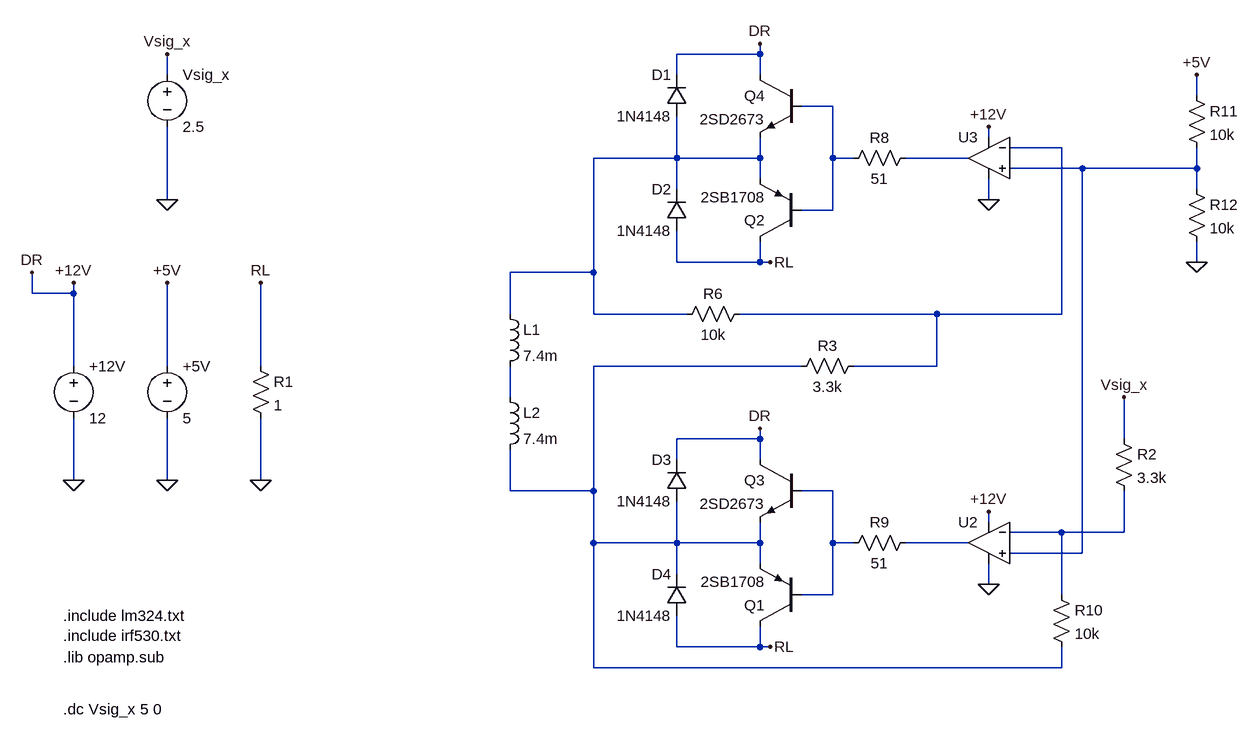
[diagram p0: schematic MagLev_02.asc]
MagLev_02.asc, the LTspice schematic file:
Version 4
SHEET 1 1432 960
WIRE -208 -1264 -208 -1280
WIRE -208 -1264 -336 -1264
WIRE -1120 -1232 -1120 -1264
WIRE -336 -1232 -336 -1264
WIRE -208 -1232 -208 -1264
WIRE 464 -1200 464 -1232
WIRE -96 -1184 -144 -1184
WIRE 144 -1136 144 -1152
WIRE 256 -1120 176 -1120
WIRE -336 -1104 -336 -1168
WIRE -336 -1104 -464 -1104
WIRE -208 -1104 -208 -1136
WIRE -208 -1104 -336 -1104
WIRE -96 -1104 -96 -1184
WIRE -64 -1104 -96 -1104
WIRE 112 -1104 16 -1104
WIRE 288 -1088 176 -1088
WIRE 464 -1088 464 -1120
WIRE 464 -1088 288 -1088
WIRE -208 -1072 -208 -1104
WIRE -336 -1056 -336 -1104
WIRE 464 -1056 464 -1088
WIRE -1120 -1040 -1120 -1152
WIRE 144 -1040 144 -1072
WIRE -96 -1024 -96 -1104
WIRE -96 -1024 -144 -1024
WIRE -336 -944 -336 -992
WIRE -208 -944 -208 -976
WIRE -208 -944 -336 -944
WIRE -192 -944 -208 -944
WIRE 464 -944 464 -976
WIRE -464 -928 -464 -1104
WIRE -464 -928 -592 -928
WIRE -1328 -896 -1328 -928
WIRE -1264 -896 -1264 -912
WIRE -1264 -896 -1328 -896
WIRE -592 -864 -592 -928
WIRE -464 -864 -464 -928
WIRE -320 -864 -464 -864
WIRE 64 -864 -240 -864
WIRE 256 -864 256 -1120
WIRE 256 -864 64 -864
WIRE -1264 -784 -1264 -896
WIRE -1120 -784 -1120 -912
WIRE -976 -784 -976 -912
WIRE -144 -784 -464 -784
WIRE 64 -784 64 -864
WIRE 64 -784 -64 -784
WIRE -592 -736 -592 -784
WIRE -208 -672 -208 -688
WIRE -208 -672 -336 -672
WIRE 352 -672 352 -736
WIRE -336 -640 -336 -672
WIRE -208 -640 -208 -672
WIRE -1264 -608 -1264 -704
WIRE -1120 -608 -1120 -704
WIRE -976 -608 -976 -704
WIRE -592 -592 -592 -656
WIRE -464 -592 -464 -784
WIRE -464 -592 -592 -592
WIRE -96 -592 -144 -592
WIRE 144 -544 144 -560
WIRE 256 -528 176 -528
WIRE 352 -528 352 -592
WIRE 352 -528 256 -528
WIRE -464 -512 -464 -592
WIRE -336 -512 -336 -576
WIRE -336 -512 -464 -512
WIRE -208 -512 -208 -544
WIRE -208 -512 -336 -512
WIRE -96 -512 -96 -592
WIRE -64 -512 -96 -512
WIRE 112 -512 16 -512
WIRE 288 -496 288 -1088
WIRE 288 -496 176 -496
WIRE -208 -480 -208 -512
WIRE -336 -464 -336 -512
WIRE 144 -448 144 -480
WIRE -96 -432 -96 -512
WIRE -96 -432 -144 -432
WIRE 256 -432 256 -528
WIRE -336 -352 -336 -400
WIRE -208 -352 -208 -384
WIRE -208 -352 -336 -352
WIRE -192 -352 -208 -352
WIRE -464 -320 -464 -512
WIRE 256 -320 256 -352
WIRE 256 -320 -464 -320
FLAG -1120 -608 0
FLAG -1264 -912 +12V
FLAG -1264 -608 0
FLAG -1120 -912 +5V
FLAG -1120 -1040 0
FLAG -1120 -1264 Vsig_x
FLAG 464 -1232 +5V
FLAG 464 -944 0
FLAG -976 -608 0
FLAG -976 -912 RL
FLAG -1328 -928 DR
FLAG 352 -736 Vsig_x
FLAG -208 -688 DR
FLAG -192 -352 RL
FLAG -208 -1280 DR
FLAG -192 -944 RL
FLAG 144 -1040 0
FLAG 144 -1152 +12V
FLAG 144 -448 0
FLAG 144 -560 +12V
SYMBOL voltage -1120 -800 R0
WINDOW 123 0 0 Left 0
WINDOW 39 0 0 Left 0
SYMATTR InstName +5V
SYMATTR Value 5
SYMBOL voltage -1264 -800 R0
WINDOW 123 0 0 Left 0
WINDOW 39 0 0 Left 0
SYMATTR InstName +12V
SYMATTR Value 12
SYMBOL voltage -1120 -1248 R0
WINDOW 123 0 0 Left 0
WINDOW 39 0 0 Left 0
SYMATTR InstName Vsig_x
SYMATTR Value 2.5
SYMBOL res -224 -880 R90
WINDOW 0 0 56 VBottom 2
WINDOW 3 32 56 VTop 2
SYMATTR InstName R6
SYMATTR Value 10k
SYMBOL ind -608 -880 R0
SYMATTR InstName L1
SYMATTR Value 7.4m
SYMATTR SpiceLine Rser=6
SYMBOL res 32 -1120 R90
WINDOW 0 0 56 VBottom 2
WINDOW 3 32 56 VTop 2
SYMATTR InstName R8
SYMATTR Value 51
SYMBOL res 32 -528 R90
WINDOW 0 0 56 VBottom 2
WINDOW 3 32 56 VTop 2
SYMATTR InstName R9
SYMATTR Value 51
SYMBOL res 240 -448 R0
SYMATTR InstName R10
SYMATTR Value 10k
SYMBOL res 448 -1216 R0
SYMATTR InstName R11
SYMATTR Value 10k
SYMBOL res 448 -1072 R0
SYMATTR InstName R12
SYMATTR Value 10k
SYMBOL res -992 -800 R0
SYMATTR InstName R1
SYMATTR Value 1
SYMBOL res 336 -688 R0
SYMATTR InstName R2
SYMATTR Value 3.3k
SYMBOL res -48 -800 R90
WINDOW 0 0 56 VBottom 2
WINDOW 3 32 56 VTop 2
SYMATTR InstName R3
SYMATTR Value 3.3k
SYMBOL diode -320 -576 R180
WINDOW 0 24 64 Left 2
WINDOW 3 24 0 Left 2
SYMATTR InstName D3
SYMATTR Value 1N4148
SYMBOL diode -320 -400 R180
WINDOW 0 24 64 Left 2
WINDOW 3 24 0 Left 2
SYMATTR InstName D4
SYMATTR Value 1N4148
SYMBOL pnp -144 -384 R180
SYMATTR InstName Q1
SYMATTR Value 2SB1708
SYMBOL npn -144 -640 M0
SYMATTR InstName Q3
SYMATTR Value 2SD2673
SYMBOL diode -320 -1168 R180
WINDOW 0 24 64 Left 2
WINDOW 3 24 0 Left 2
SYMATTR InstName D1
SYMATTR Value 1N4148
SYMBOL diode -320 -992 R180
WINDOW 0 24 64 Left 2
WINDOW 3 24 0 Left 2
SYMATTR InstName D2
SYMATTR Value 1N4148
SYMBOL pnp -144 -976 R180
SYMATTR InstName Q2
SYMATTR Value 2SB1708
SYMBOL npn -144 -1232 M0
SYMATTR InstName Q4
SYMATTR Value 2SD2673
SYMBOL OpAmps\\UniversalOpAmp2 144 -1104 M0
SYMATTR InstName U3
SYMBOL OpAmps\\UniversalOpAmp2 144 -512 M0
SYMATTR InstName U2
SYMBOL ind -608 -752 R0
SYMATTR InstName L2
SYMATTR Value 7.4m
SYMATTR SpiceLine Rser=6
TEXT -1280 -400 Left 2 !.include lm324.txt\n.include irf530.txt
TEXT -1280 -256 Left 2 !.dc Vsig_x 5 0
TEXT -1280 -336 Left 2 !.lib opamp.sub

The netlist it stands for:
* MagLev_02.asc
V§+5V +5V 0 5
V§+12V DR 0 12
Vsig_x Vsig_x 0 2.5
R6 N002 N003 10k
L1 N003 N007 7.4m Rser=6
R8 N004 N001 51
R9 N010 N008 51
R10 N009 N006 10k
R11 +5V N005 10k
R12 N005 0 10k
R1 RL 0 1
R2 Vsig_x N009 3.3k
R3 N002 N006 3.3k
D3 N006 DR 1N4148
D4 RL N006 1N4148
Q1 RL N008 N006 0 2SB1708
Q3 DR N008 N006 0 2SD2673
D1 N003 DR 1N4148
D2 RL N003 1N4148
Q2 RL N001 N003 0 2SB1708
Q4 DR N001 N003 0 2SD2673
XU3 N005 N002 DR 0 N004 level2 Avol=1Meg GBW=10Meg Slew=10Meg Ilimit=25m Rail=0 Vos=0 En=0 Enk=0 In=0 Ink=0 Rin=500Meg  ; pins In+ In- V+ V- OUT
XU2 N005 N009 DR 0 N010 level2 Avol=1Meg GBW=10Meg Slew=10Meg Ilimit=25m Rail=0 Vos=0 En=0 Enk=0 In=0 Ink=0 Rin=500Meg  ; pins In+ In- V+ V- OUT
L2 N007 N006 7.4m Rser=6
.model D D
.lib standard.dio
.model NPN NPN
.model PNP PNP
.lib standard.bjt
.include lm324.txt
.include irf530.txt
.dc Vsig_x 5 0
.lib opamp.sub
.lib UniversalOpAmp2.lib
.backanno
.end